# EAGLE design eCog120_VGA (EAGLE 6.6.0)
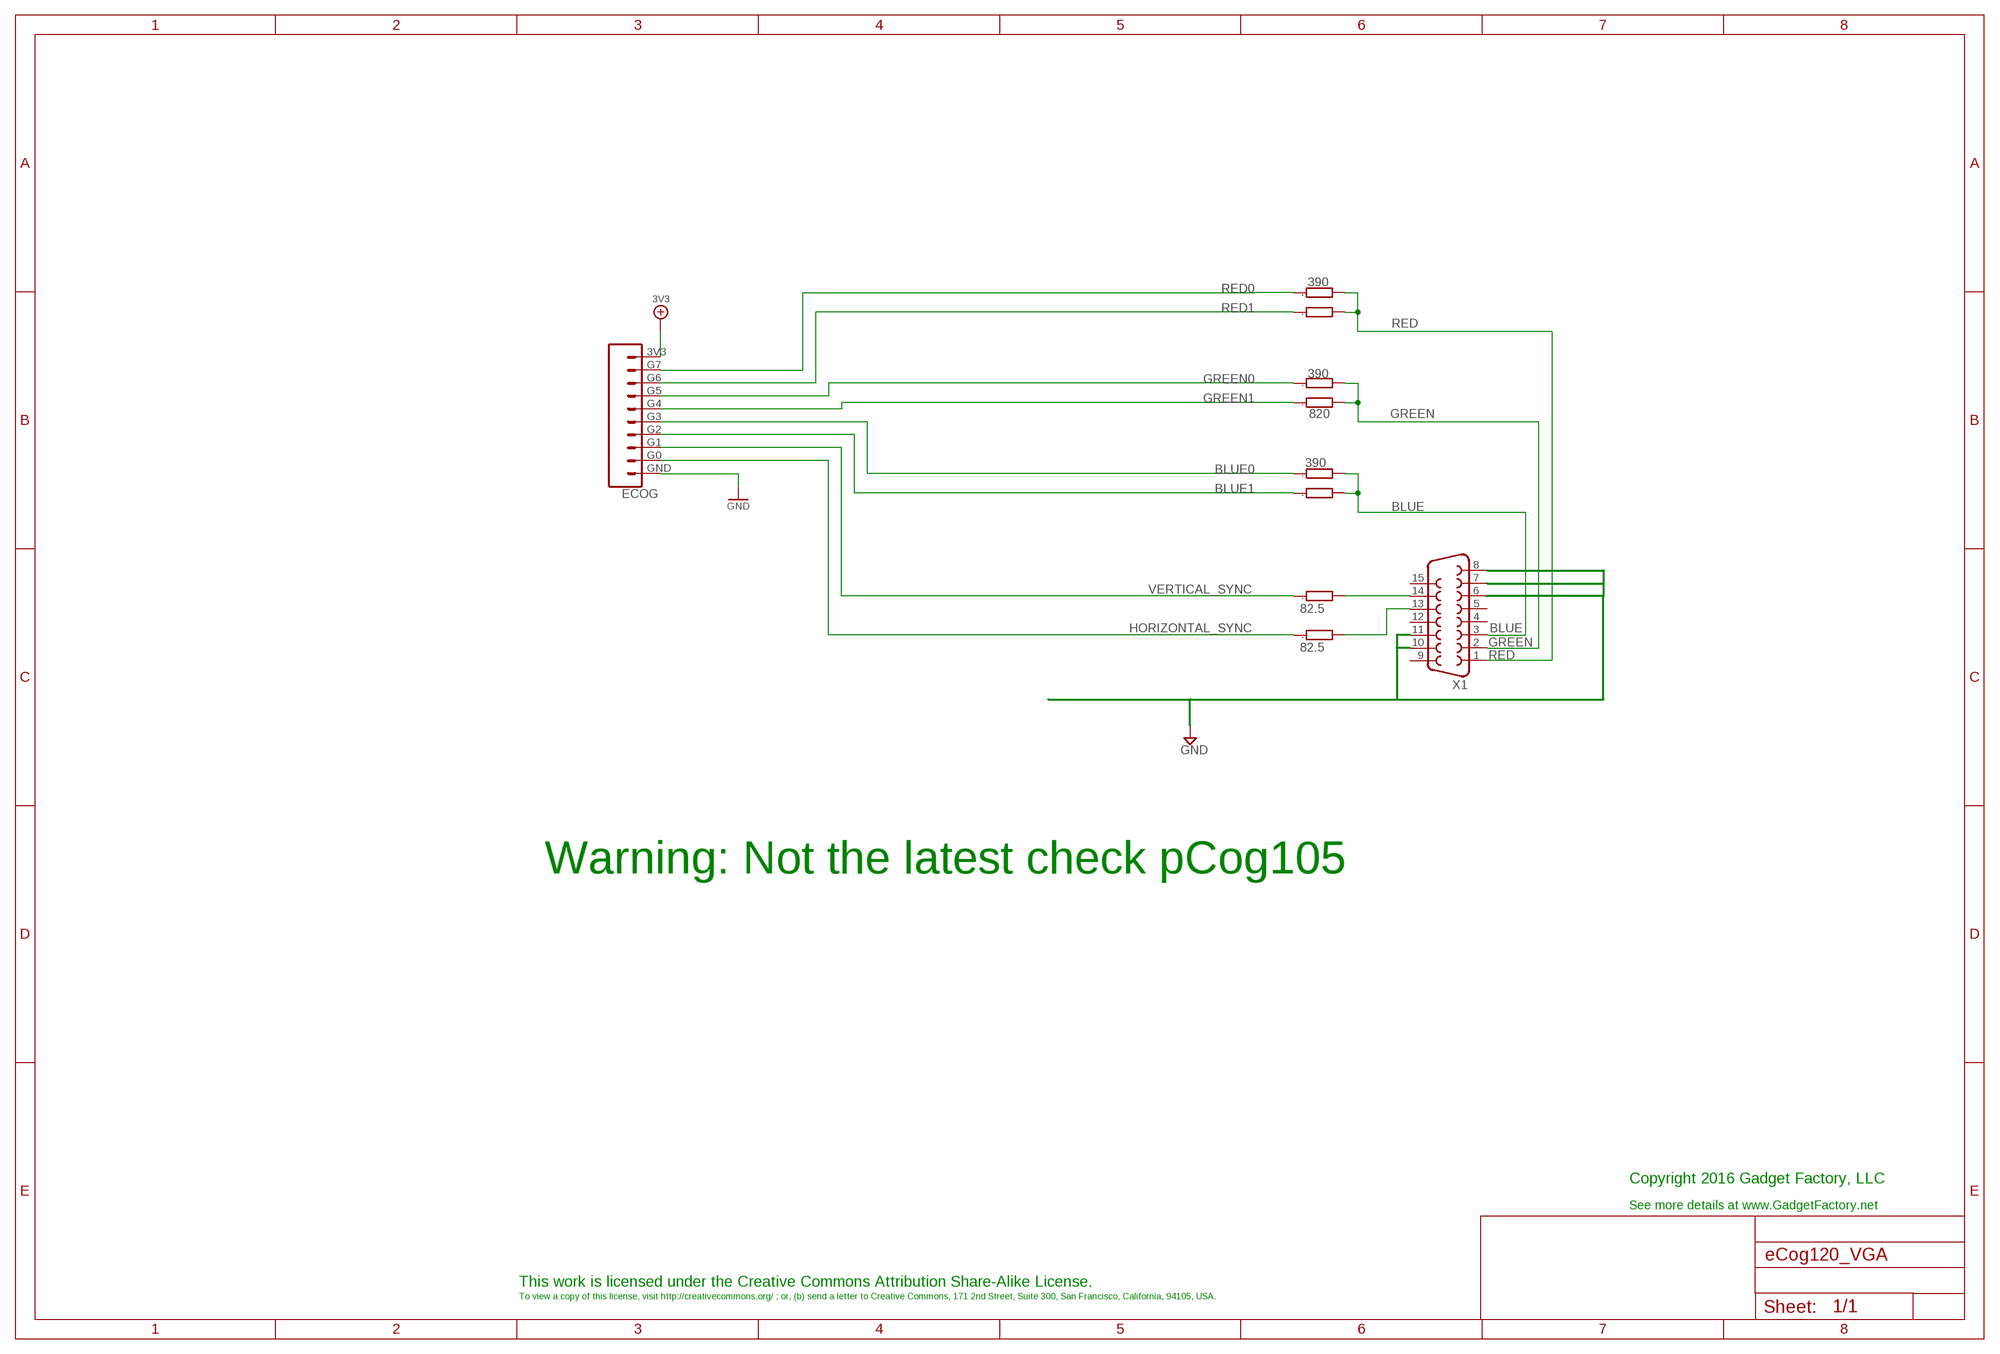
[diagram p0: schematic, sheet 1]

## Parts
ECOG  ECOG_GENERAL_ROWTHROUGHOLE  [ECOG_GENERAL_TH]
R34  390  R0603  [0603]
R35  820  R0603  [0603]
R40  820  R0603  [0603]
R41  390  R0603  [0603]
R44  820  R0603  [0603]
R45  390  R0603  [0603]
R46  82.5  R0603  [0603]
R47  82.5  R0603  [0603]
X1  F15HDH  [HDF15H]

## Nets
3V3: ECOG.3V3
BLUE: R44.2 R45.2 X1.3
BLUE0: ECOG.G3 R45.1
BLUE1: ECOG.G2 R44.1
GND: ECOG.GND X1.6 X1.7 X1.8 X1.10 X1.11
GREEN: R40.2 R41.2 X1.2
GREEN0: ECOG.G5 R41.1
GREEN1: ECOG.G4 R40.1
HORIZONTAL_SYNC: ECOG.G0 R47.1
N$4: R47.2 X1.13
N$5: R46.2 X1.14
RED: R34.2 R35.2 X1.1
RED0: ECOG.G7 R34.1
RED1: ECOG.G6 R35.1
VERTICAL_SYNC: ECOG.G1 R46.1
Unconnected: X1.4 X1.5 X1.9 X1.12 X1.15

## Notes on the sheet
- Warning: Not the latest check pCog105
- Copyright 2016 Gadget Factory, LLC
- See more details at www.GadgetFactory.net
- This work is licensed under the Creative Commons Attribution Share-Alike License.
- To view a copy of this license, visit http://creativecommons.org/ ; or, (b) send a letter to Creative Commons, 171 2nd Street, Suite 300, San Francisco, California, 94105, USA.

## Library data of the parts
ECOG = eCogs:ECOG_GENERAL_ROW
R34 R41 R45 = GadgetFactory:R: RESISTOR, European symbol; PARTNO: RMCF0603JT3K90
R35 R40 R44 = GadgetFactory:R: RESISTOR, European symbol; PARTNO: RMCF0603JT2K00
R46 R47 = GadgetFactory:R: RESISTOR, European symbol; PARTNO: RMCF0603FT82R5
X1 = GadgetFactory_6.0:F15: SUB-D; OC_FARNELL: unknown; OC_NEWARK: unknown; PARTNO: 1-1734530-1

## Board
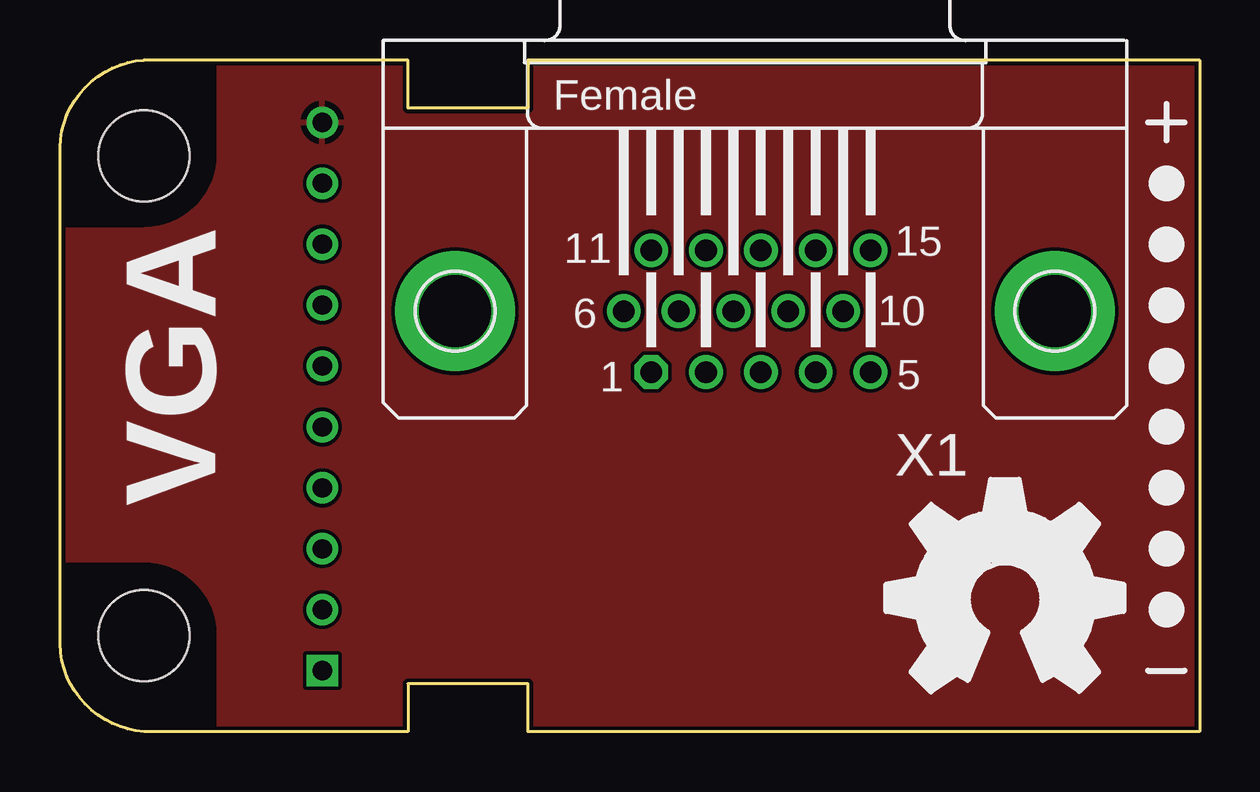
[diagram p1: board, top side]
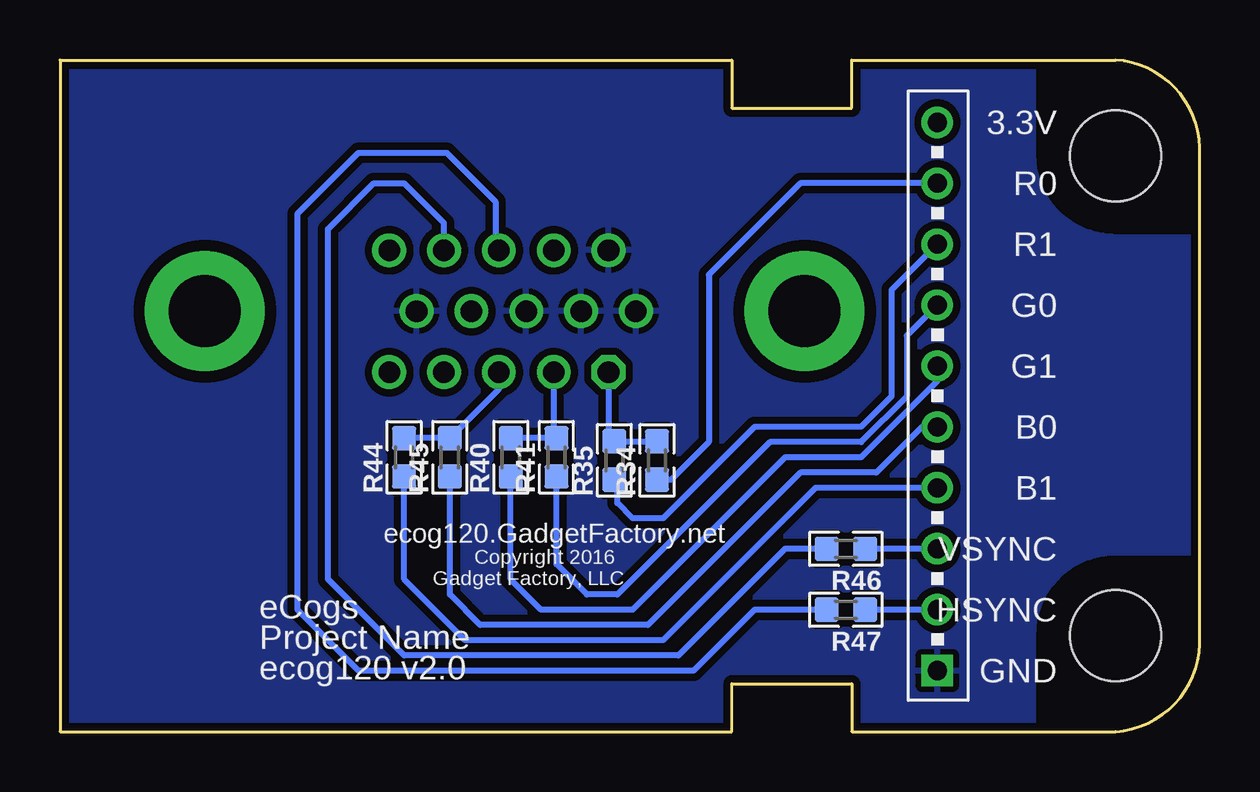
[diagram p2: board, bottom side, seen from below]

Size 47.51 x 28 mm. Coordinates in mm from the lower left corner, seen from the top.
Copper layers (1*16): Top 0.035mm / dielectric 1.5mm / Bottom 0.035mm
Design rules "hackvana *": minimum track width 6mil, minimum drill 0.3mm, track to track 6mil, track to pad 6mil, pad to pad 6mil, via to via 6mil, smd to smd 0mil, copper to edge 6mil, drill to drill 6mil, minimum pad ring 10mil, minimum via ring 6mil, stop-mask expansion 2mil, vias tented up to drill 100mil, thermal gap 10mil

### Footprints (pad centres in the part's own frame; a part is rotated, then mirrored left to right if it is on the bottom)
ECOG_GENERAL_TH = drill 0.8: 3V3 11.43,25.4; G0 11.43,5.08; G1 11.43,7.62; G2 11.43,10.16; G3 11.43,12.7; G4 11.43,15.24; G5 11.43,17.78; G6 11.43,20.32; G7 11.43,22.86 | drill 0.8 square: GND 11.43,2.54 | hole 3.8: 4,24; 4,4
0603 = smd 1 x 1: 1 -0.8,0; 2 0.8,0
HDF15H = drill 0.9 octagon: 1 4.329,2.54 | drill 0.9: 2 2.043,2.54; 3 -0.243,2.54; 4 -2.529,2.54; 5 -4.815,2.54; 6 5.472,0; 7 3.186,0; 8 0.9,0; 9 -1.386,0; 10 -3.672,0; 11 4.329,-2.54; 12 2.043,-2.54; 13 -0.243,-2.54; 14 -2.529,-2.54; 15 -4.815,-2.54 | drill 3 pad 5: P$1 -12.5,0; P$2 12.5,0

### Placement (x,y rotation side)
ECOG  -0.49,0 0 top
R34  22.62,11.3 90 bottom
R35  24.4,11.3 90 bottom
R40  28.72,11.43 90 bottom
R41  26.81,11.43 90 bottom
R44  33.16,11.43 90 bottom
R45  31.26,11.43 90 bottom
R46  14.75,7.62 180 bottom
R47  14.75,5.08 180 bottom
U$1  [LEGEND_DIO]  46.12,15.24 0 top
U$2  [LEGEND_DIO]  46.12,22.86 0 top
U$3  [LEGEND_DIO]  46.12,20.32 0 top
U$4  [LEGEND_DIO]  46.12,17.78 0 top
U$5  [LEGEND_DIO]  46.12,12.7 0 top
U$6  [LEGEND_DIO]  46.12,10.16 0 top
U$7  [LEGEND_DIO]  46.12,7.62 0 top
U$8  [LEGEND_DIO]  46.12,5.08 0 top
U$10  [OSHW_FILLX350_NOTEXT]  34.43,1.65 0 top
X1  28.97,17.53 180 top

### Tracks (layer width: path | path; a pad name or v marks a point on that pad's centre or on a via)
3V3
  pour Top: -1.49,29 48.51,29 48.51,-1 -1.49,-1
BLUE
  Bottom 0.254: X1.3 29.21,14.27 R45.2 R44.2
BLUE0
  Bottom 0.254: ECOG.G3 11.57,12.7 13.48,10.79 16.65,10.79 23,4.45 29.99,4.45 31.26,5.71 R45.1
BLUE1
  Bottom 0.254: ECOG.G2 16.02,10.16 22.37,3.81 30.62,3.81 33.16,6.35 R44.1
GND
  pour Bottom (isolate 0.305): -2.49,30 49.51,30 49.51,-2 -2.49,-2
GREEN
  Bottom 0.254: X1.2 26.93,12.35 R41.2 R40.2
GREEN0
  Bottom 0.254: R41.1 26.81,6.99 25.54,5.71 24.27,5.71 17.92,12.06 14.11,12.06 12.21,13.97 12.21,16.51 ECOG.G5
GREEN1
  Bottom 0.254: ECOG.G4 10.94,14.61 14.11,11.43 17.29,11.43 23.64,5.08 27.45,5.08 28.72,6.35 R40.1
HORIZONTAL_SYNC
  Bottom 0.254: ECOG.G0 R47.1
N$4
  Bottom 0.254: R47.2 18.56,5.08 21.1,2.54 35.07,2.54 37.61,5.08 37.61,21.59 35.07,24.13 31.38,24.13 29.35,22.1 29.35,20.2 X1.13
N$5
  Bottom 0.254: R46.2 17.29,7.62 21.73,3.17 33.16,3.17 36.34,6.35 36.34,20.95 34.43,22.86 33.16,22.86 31.5,21.2 X1.14
RED
  Bottom 0.254: X1.1 24.64,12.35 R35.2 R34.2
RED0
  Bottom 0.254: R34.1 22.02,10.5 20.46,12.06 20.46,19.05 16.65,22.86 ECOG.G7
RED1
  Bottom 0.254: R35.1 24.27,10.38 24.27,9.53 23.64,8.89 22.37,8.89 18.56,12.7 14.11,12.7 12.84,13.97 12.84,18.41 ECOG.G6
VERTICAL_SYNC
  Bottom 0.254: ECOG.G1 R46.1

### Text on the board
tPlace: VGA
bPlace: 3.3V | R0 | R1 | G0 | G1 | B0 | B1 | VSYNC | ecog120.GadgetFactory.net | Copyright 2016 | HSYNC | Gadget Factory, LLC | eCogs | GND | Project Name | ecog120 v2.0